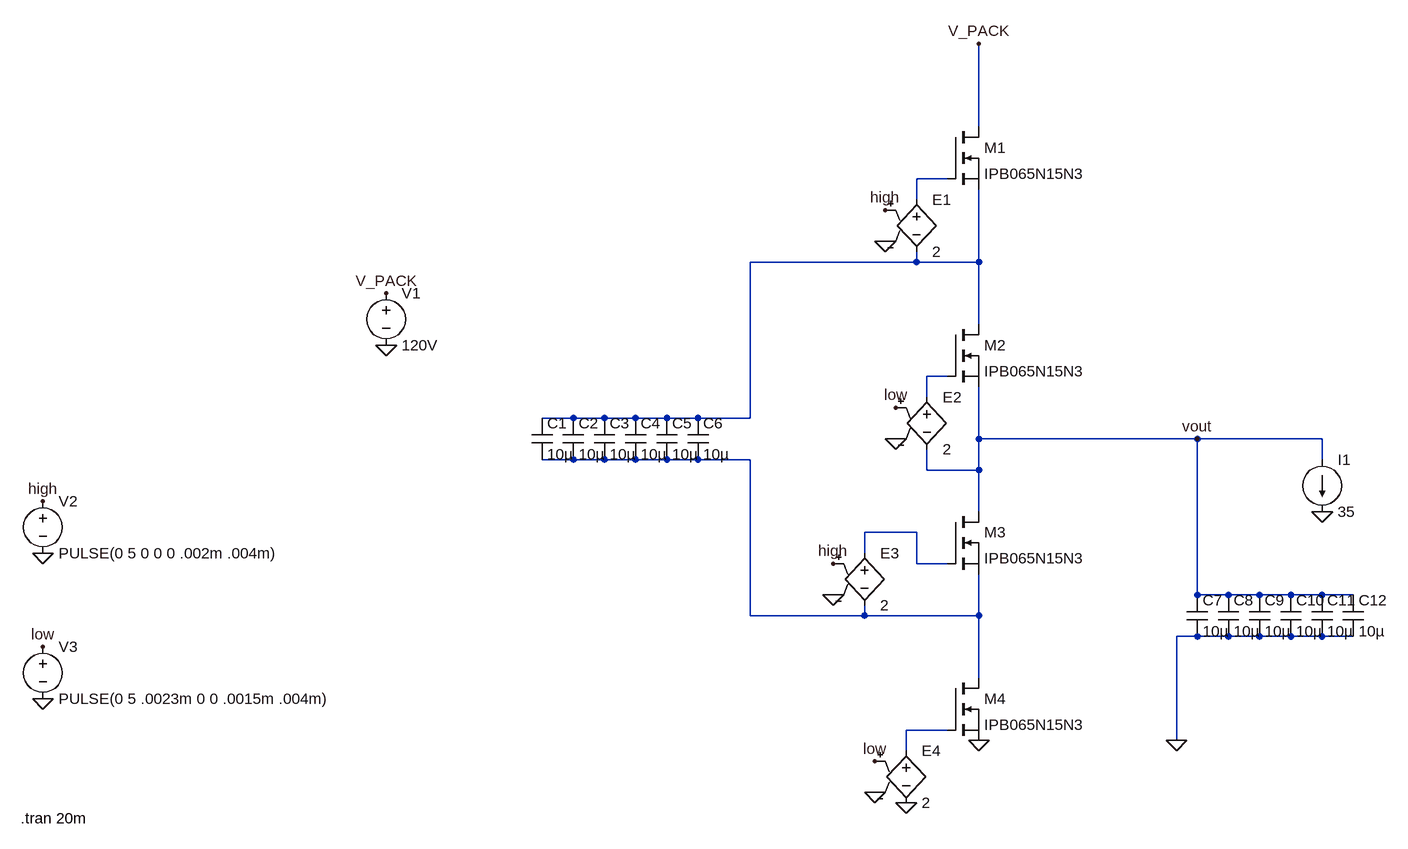
[diagram p0: schematic Draft3.asc]
Draft3.asc, the LTspice schematic file:
Version 4
SHEET 1 1560 936
WIRE 928 -144 928 -272
WIRE 880 -64 832 -64
WIRE 832 -32 832 -64
WIRE 832 64 832 48
WIRE 832 64 576 64
WIRE 928 64 928 -48
WIRE 928 64 832 64
WIRE 928 160 928 64
WIRE 880 240 848 240
WIRE 848 272 848 240
WIRE 304 304 256 304
WIRE 352 304 304 304
WIRE 400 304 352 304
WIRE 448 304 400 304
WIRE 496 304 448 304
WIRE 576 304 576 64
WIRE 576 304 496 304
WIRE 928 336 928 256
WIRE 1264 336 928 336
WIRE 1456 336 1264 336
WIRE 304 368 256 368
WIRE 352 368 304 368
WIRE 400 368 352 368
WIRE 448 368 400 368
WIRE 496 368 448 368
WIRE 576 368 496 368
WIRE 1456 368 1456 336
WIRE 848 384 848 352
WIRE 928 384 928 336
WIRE 928 384 848 384
WIRE 928 448 928 384
WIRE 832 480 752 480
WIRE 752 512 752 480
WIRE 832 528 832 480
WIRE 880 528 832 528
WIRE 1264 576 1264 336
WIRE 1312 576 1264 576
WIRE 1360 576 1312 576
WIRE 1408 576 1360 576
WIRE 1456 576 1408 576
WIRE 1504 576 1456 576
WIRE 576 608 576 368
WIRE 752 608 752 592
WIRE 752 608 576 608
WIRE 928 608 928 544
WIRE 928 608 752 608
WIRE 1264 640 1232 640
WIRE 1312 640 1264 640
WIRE 1360 640 1312 640
WIRE 1408 640 1360 640
WIRE 1456 640 1408 640
WIRE 1504 640 1456 640
WIRE 928 704 928 608
WIRE 880 784 816 784
WIRE 1232 800 1232 640
WIRE 816 816 816 784
FLAG 16 192 0
FLAG 16 112 V_PACK
FLAG 928 800 0
FLAG 928 -272 V_PACK
FLAG 1232 800 0
FLAG 1264 336 vout
FLAG 816 896 0
FLAG 784 32 0
FLAG 800 336 0
FLAG 704 576 0
FLAG 768 880 0
FLAG -512 736 0
FLAG -512 512 0
FLAG -512 432 high
FLAG -512 656 low
FLAG 784 -16 high
FLAG 704 528 high
FLAG 800 288 low
FLAG 768 832 low
FLAG 1456 448 0
SYMBOL voltage 16 96 R0
WINDOW 123 0 0 Left 0
WINDOW 39 0 0 Left 0
SYMATTR InstName V1
SYMATTR Value 120V
SYMBOL nmos 880 -144 R0
SYMATTR InstName M1
SYMATTR Value IPB065N15N3
SYMBOL cap 240 304 R0
SYMATTR InstName C1
SYMATTR Value 10µ
SYMBOL cap 288 304 R0
SYMATTR InstName C2
SYMATTR Value 10µ
SYMBOL cap 336 304 R0
SYMATTR InstName C3
SYMATTR Value 10µ
SYMBOL cap 384 304 R0
SYMATTR InstName C4
SYMATTR Value 10µ
SYMBOL cap 432 304 R0
SYMATTR InstName C5
SYMATTR Value 10µ
SYMBOL cap 480 304 R0
SYMATTR InstName C6
SYMATTR Value 10µ
SYMBOL nmos 880 160 R0
SYMATTR InstName M2
SYMATTR Value IPB065N15N3
SYMBOL nmos 880 448 R0
SYMATTR InstName M3
SYMATTR Value IPB065N15N3
SYMBOL nmos 880 704 R0
SYMATTR InstName M4
SYMATTR Value IPB065N15N3
SYMBOL cap 1248 576 R0
SYMATTR InstName C7
SYMATTR Value 10µ
SYMBOL cap 1296 576 R0
SYMATTR InstName C8
SYMATTR Value 10µ
SYMBOL cap 1344 576 R0
SYMATTR InstName C9
SYMATTR Value 10µ
SYMBOL cap 1392 576 R0
SYMATTR InstName C10
SYMATTR Value 10µ
SYMBOL cap 1440 576 R0
SYMATTR InstName C11
SYMATTR Value 10µ
SYMBOL cap 1488 576 R0
SYMATTR InstName C12
SYMATTR Value 10µ
SYMBOL e 832 -48 R0
SYMATTR InstName E1
SYMATTR Value 2
SYMBOL e 848 256 R0
SYMATTR InstName E2
SYMATTR Value 2
SYMBOL e 752 496 R0
SYMATTR InstName E3
SYMATTR Value 2
SYMBOL e 816 800 R0
SYMATTR InstName E4
SYMATTR Value 2
SYMBOL voltage -512 416 R0
WINDOW 123 0 0 Left 0
WINDOW 39 0 0 Left 0
SYMATTR InstName V2
SYMATTR Value PULSE(0 5 0 0 0 .002m .004m)
SYMBOL voltage -512 640 R0
WINDOW 123 0 0 Left 0
WINDOW 39 0 0 Left 0
SYMATTR InstName V3
SYMATTR Value PULSE(0 5 .0023m 0 0 .0015m .004m)
SYMBOL current 1456 368 R0
WINDOW 123 0 0 Left 0
WINDOW 39 0 0 Left 0
SYMATTR InstName I1
SYMATTR Value 35
TEXT -546 920 Left 2 !.tran 20m

The netlist it stands for:
* Draft3.asc
V1 V_PACK 0 120V
M1 V_PACK N001 N002 N002 IPB065N15N3
C1 N002 N004 10µ
C2 N002 N004 10µ
C3 N002 N004 10µ
C4 N002 N004 10µ
C5 N002 N004 10µ
C6 N002 N004 10µ
M2 N002 N003 vout vout IPB065N15N3
M3 vout N005 N004 N004 IPB065N15N3
M4 N004 N006 0 0 IPB065N15N3
C7 vout 0 10µ
C8 vout 0 10µ
C9 vout 0 10µ
C10 vout 0 10µ
C11 vout 0 10µ
C12 vout 0 10µ
E1 N001 N002 high 0 2
E2 N003 vout low 0 2
E3 N005 N004 high 0 2
E4 N006 0 low 0 2
V2 high 0 PULSE(0 5 0 0 0 .002m .004m)
V3 low 0 PULSE(0 5 .0023m 0 0 .0015m .004m)
I1 vout 0 35
.model NMOS NMOS
.model PMOS PMOS
.lib standard.mos
.tran 20m
.backanno
.end